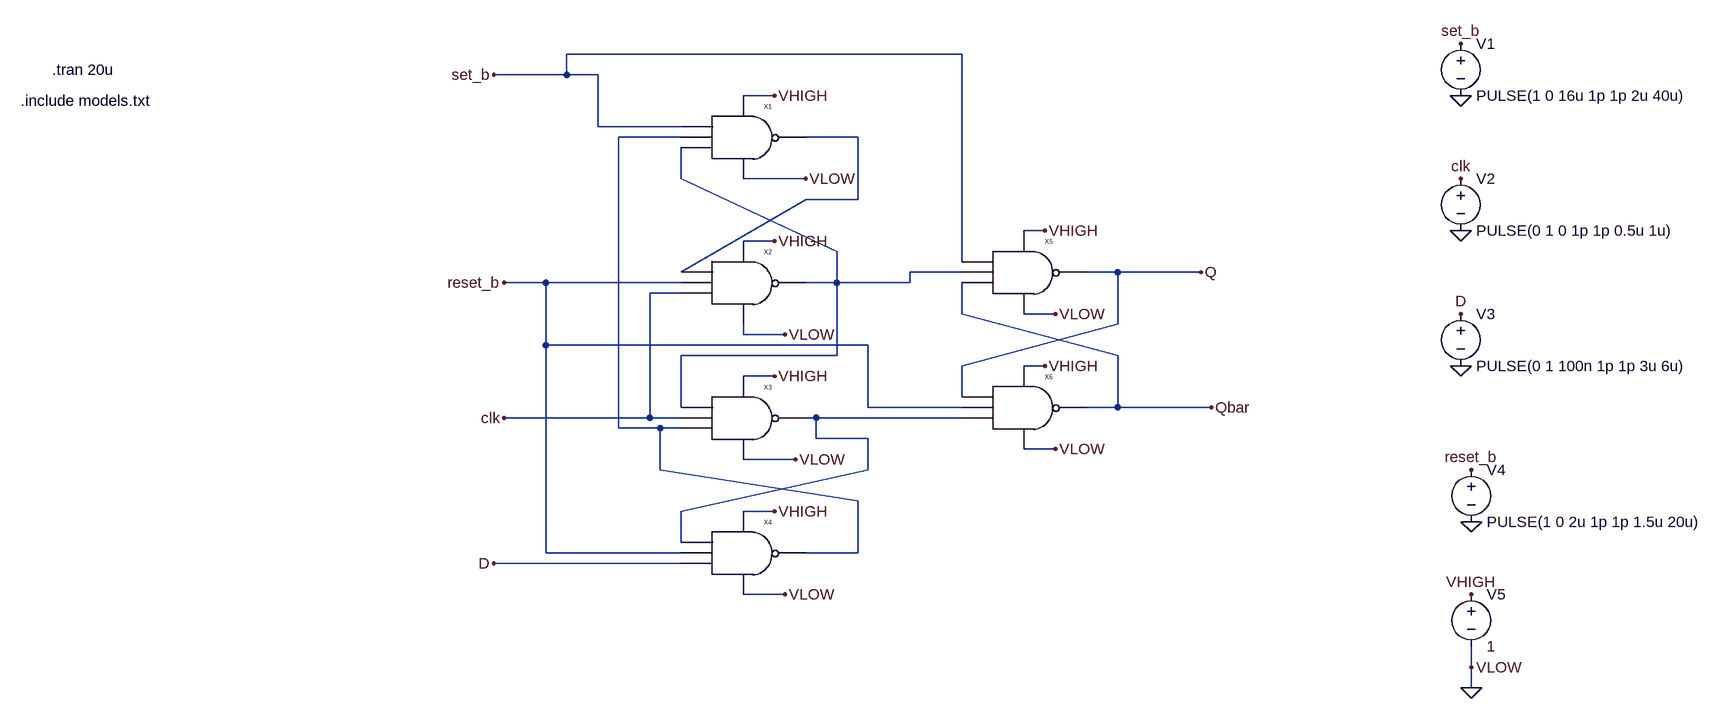
[diagram p0: schematic Dff.asc]
Dff.asc, the LTspice schematic file:
Version 4
SHEET 1 1720 912
WIRE 560 -112 -48 -112
WIRE -48 -80 -48 -112
WIRE -48 -80 -160 -80
WIRE 0 -80 -48 -80
WIRE 272 -48 224 -48
WIRE 0 0 0 -80
WIRE 128 0 0 0
WIRE 128 16 32 16
WIRE 400 16 320 16
WIRE 128 80 128 32
WIRE 320 80 224 80
WIRE 400 112 400 16
WIRE 400 112 320 112
WIRE 688 160 656 160
WIRE 272 176 224 176
WIRE 368 192 128 80
WIRE 560 208 560 -112
WIRE 128 224 320 112
WIRE 560 224 480 224
WIRE 800 224 752 224
WIRE 928 224 800 224
WIRE -80 240 -144 240
WIRE 128 240 -80 240
WIRE 368 240 368 192
WIRE 368 240 320 240
WIRE 480 240 480 224
WIRE 480 240 368 240
WIRE 128 256 80 256
WIRE 560 288 560 240
WIRE 704 288 656 288
WIRE 800 304 800 224
WIRE 224 320 224 304
WIRE 288 320 224 320
WIRE -80 336 -80 240
WIRE 416 336 -80 336
WIRE 368 352 368 240
WIRE 368 352 128 352
WIRE 800 352 560 288
WIRE 560 368 800 304
WIRE 688 368 656 368
WIRE 272 384 224 384
WIRE 560 416 560 368
WIRE 128 432 128 352
WIRE 416 432 416 336
WIRE 560 432 416 432
WIRE 800 432 800 352
WIRE 800 432 752 432
WIRE 944 432 800 432
WIRE 80 448 80 256
WIRE 80 448 -144 448
WIRE 128 448 80 448
WIRE 336 448 320 448
WIRE 560 448 336 448
WIRE 32 464 32 16
WIRE 96 464 32 464
WIRE 128 464 96 464
WIRE 336 480 336 448
WIRE 416 480 336 480
WIRE 704 496 656 496
WIRE 304 512 224 512
WIRE 96 528 96 464
WIRE 416 528 416 480
WIRE 400 576 96 528
WIRE 128 592 416 528
WIRE 272 592 224 592
WIRE 128 640 128 592
WIRE -80 656 -80 336
WIRE 128 656 -80 656
WIRE 400 656 400 576
WIRE 400 656 320 656
WIRE 128 672 -160 672
WIRE 288 720 224 720
WIRE 1344 832 1344 800
WIRE 1344 864 1344 832
FLAG 272 -48 VHIGH
FLAG 272 176 VHIGH
FLAG 272 384 VHIGH
FLAG 272 592 VHIGH
FLAG 688 160 VHIGH
FLAG 688 368 VHIGH
FLAG 320 80 VLOW
FLAG 288 320 VLOW
FLAG 304 512 VLOW
FLAG 288 720 VLOW
FLAG 704 496 VLOW
FLAG 704 288 VLOW
FLAG -160 -80 set_b
FLAG -144 240 reset_b
FLAG -144 448 clk
FLAG -160 672 D
FLAG 928 224 Q
FLAG 944 432 Qbar
FLAG 1344 864 0
FLAG 1344 720 VHIGH
FLAG 1344 832 VLOW
FLAG 1328 -128 set_b
FLAG 1328 -48 0
FLAG 1328 160 0
FLAG 1328 368 0
FLAG 1344 608 0
FLAG 1328 80 clk
FLAG 1328 288 D
FLAG 1344 528 reset_b
SYMBOL NAND 240 16 R0
SYMATTR InstName X1
SYMBOL NAND 240 240 R0
SYMATTR InstName X2
SYMBOL NAND 240 448 R0
SYMATTR InstName X3
SYMBOL NAND 240 656 R0
SYMATTR InstName X4
SYMBOL NAND 672 224 R0
SYMATTR InstName X5
SYMBOL NAND 672 432 R0
SYMATTR InstName X6
SYMBOL voltage 1328 -144 R0
WINDOW 123 0 0 Left 0
WINDOW 39 0 0 Left 0
SYMATTR InstName V1
SYMATTR Value PULSE(1 0 16u 1p 1p 2u 40u)
SYMBOL voltage 1328 64 R0
WINDOW 123 0 0 Left 0
WINDOW 39 0 0 Left 0
SYMATTR InstName V2
SYMATTR Value PULSE(0 1 0 1p 1p 0.5u 1u)
SYMBOL voltage 1328 272 R0
WINDOW 123 0 0 Left 0
WINDOW 39 0 0 Left 0
SYMATTR InstName V3
SYMATTR Value PULSE(0 1 100n 1p 1p 3u 6u)
SYMBOL voltage 1344 512 R0
WINDOW 123 0 0 Left 0
WINDOW 39 0 0 Left 0
SYMATTR InstName V4
SYMATTR Value PULSE(1 0 2u 1p 1p 1.5u 20u)
SYMBOL voltage 1344 704 R0
WINDOW 123 0 0 Left 0
WINDOW 39 0 0 Left 0
SYMATTR InstName V5
SYMATTR Value 1
TEXT -888 -40 Left 2 !.include models.txt
TEXT -840 -88 Left 2 !.tran 20u

The netlist it stands for:
* Dff.asc
XX1 set_b N001 N003 VHIGH 0 N002 NAND  ; pins A B C VHIGH VLOW Vout
XX2 N002 reset_b clk VHIGH 0 N003 NAND  ; pins A B C VHIGH VLOW Vout
XX3 N003 clk N001 VHIGH 0 N004 NAND  ; pins A B C VHIGH VLOW Vout
XX4 N004 reset_b D VHIGH 0 N001 NAND  ; pins A B C VHIGH VLOW Vout
XX5 set_b N003 Qbar VHIGH 0 Q NAND  ; pins A B C VHIGH VLOW Vout
XX6 Q reset_b N004 VHIGH 0 Qbar NAND  ; pins A B C VHIGH VLOW Vout
V1 set_b 0 PULSE(1 0 16u 1p 1p 2u 40u)
V2 clk 0 PULSE(0 1 0 1p 1p 0.5u 1u)
V3 D 0 PULSE(0 1 100n 1p 1p 3u 6u)
V4 reset_b 0 PULSE(1 0 2u 1p 1p 1.5u 20u)
V5 VHIGH 0 1
.include models.txt
.tran 20u
.backanno
.end